# Altium schematic sheet Analog.SchDoc
size A3
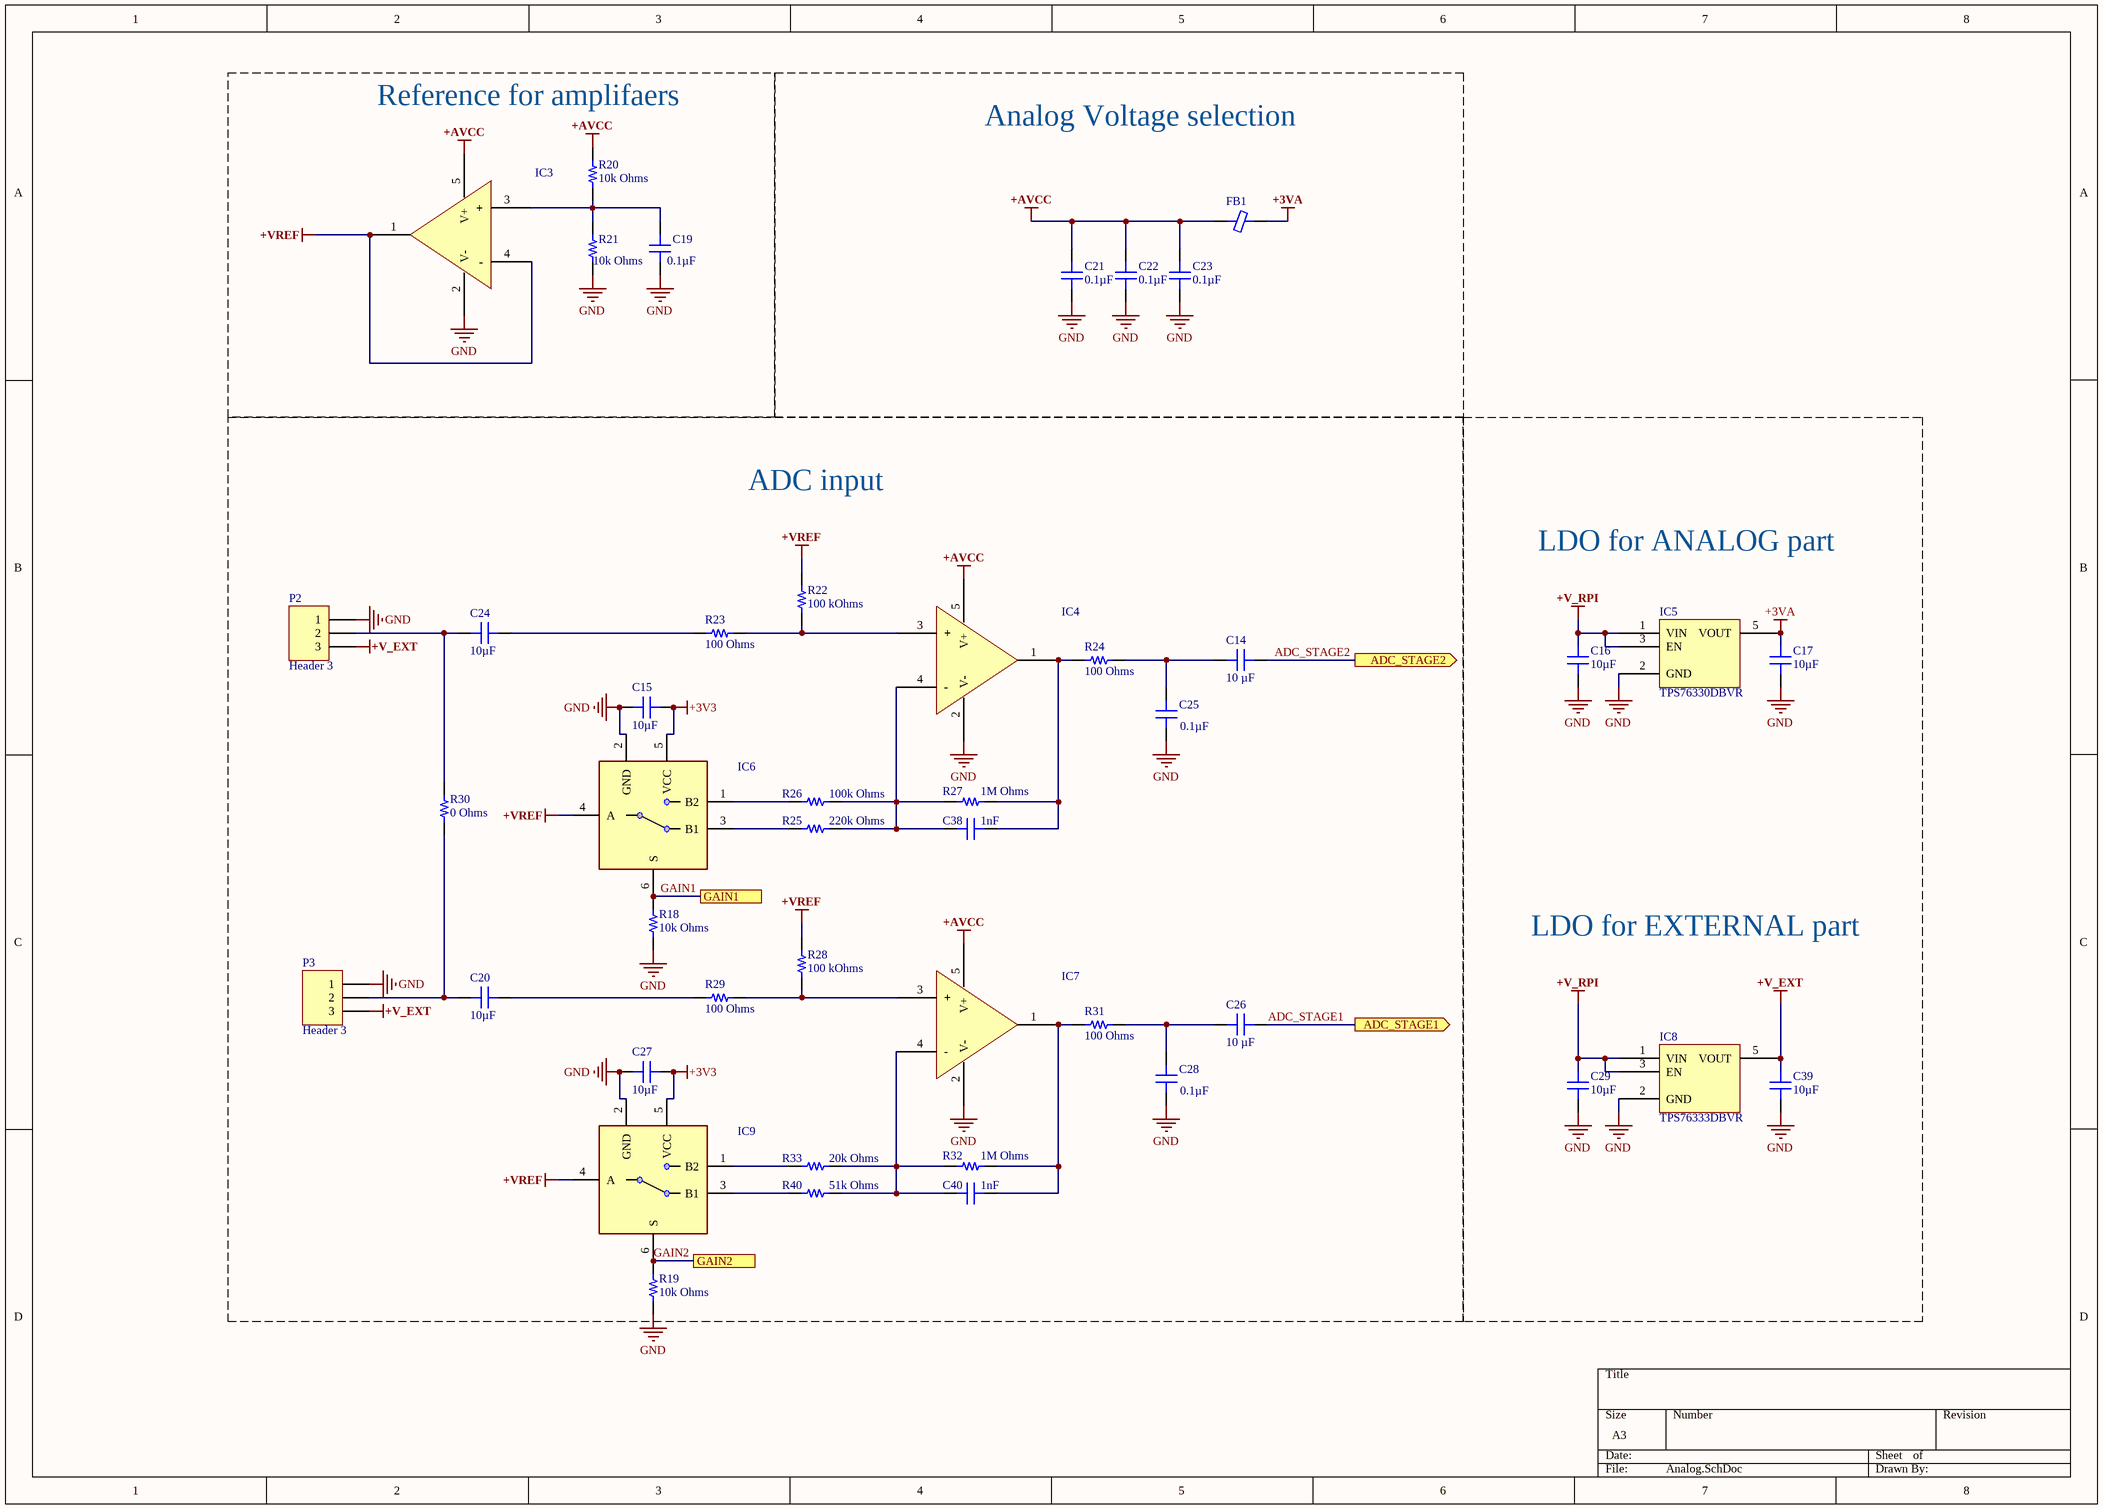
[diagram p0: Analog.SchDoc]

## Parts
C14  10 µF  [CAP 0603_1608]
C15  10µF  [CAP 0603_1608]
C16  10µF  [CAP 0603_1608]
C17  10µF  [CAP 0603_1608]
C19  0.1µF  [CAP 0603_1608]
C20  10µF  [CAP 0603_1608]
C21  0.1µF  [CAP 0603_1608]
C22  0.1µF  [CAP 0603_1608]
C23  0.1µF  [CAP 0603_1608]
C24  10µF  [CAP 0603_1608]
C25  0.1µF  [CAP 0603_1608]
C26  10 µF  [CAP 0603_1608]
C27  10µF  [CAP 0603_1608]
C28  0.1µF  [CAP 0603_1608]
C29  10µF  [CAP 0603_1608]
C38  1nF  [CAP 0603_1608]
C39  10µF  [CAP 0603_1608]
C40  1nF  [CAP 0603_1608]
FB1  (no value)  [FER 0603_1608]
IC3  AD8541ARTZ-REEL7  [ANALOG SOT-23-5 RJ-5]  (value not drawn)
IC4  AD8541ARTZ-REEL7  [ANALOG SOT-23-5 RJ-5]  (value not drawn)
IC5  TPS76330DBVR  [TI SOT-23-5 DBV]
IC6  SN74LVC1G3157DCK3  [SOT65P210X110-6N]  (value not drawn)
IC7  AD8541ARTZ-REEL7  [ANALOG SOT-23-5 RJ-5]  (value not drawn)
IC8  TPS76333DBVR  [TI SOT-23-5 DBV]
IC9  SN74LVC1G3157DCK3  [SOT65P210X110-6N]  (value not drawn)
P2  Header 3  [HDR1X3]
P3  Header 3  [HDR1X3]
R18  10k Ohms  [RES 0603_1608]
R19  10k Ohms  [RES 0603_1608]
R20  10k Ohms  [RES 0603_1608]
R21  10k Ohms  [RES 0603_1608]
R22  100 kOhms  [RES 0603_1608]
R23  100 Ohms  [RES 0603_1608]
R24  100 Ohms  [RES 0603_1608]
R25  220k Ohms  [RES 0603_1608]
R26  100k Ohms  [RES 0603_1608]
R27  1M Ohms  [RES 0603_1608]
R28  100 kOhms  [RES 0603_1608]
R29  100 Ohms  [RES 0603_1608]
R30  0 Ohms  [RES 0603_1608]
R31  100 Ohms  [RES 0603_1608]
R32  1M Ohms  [RES 0603_1608]
R33  20k Ohms  [RES 0603_1608]
R40  51k Ohms  [RES 0603_1608]

## Ports
ADC_STAGE1 (out), ADC_STAGE2 (out), GAIN1, GAIN2

## Nets
+3V3: C15.1 C27.1 IC6.5(VCC) IC9.5(VCC)
+3VA: C17.2 FB1.2 IC5.5(VOUT)
+AVCC: C21.2 C22.2 C23.2 FB1.1 IC3.5(V+) IC4.5(V+) IC7.5(V+) R20.2
+V_EXT: C39.2 IC8.5(VOUT) P2.3 P3.3
+V_RPI: C16.2 C29.2 IC5.1(VIN) IC5.3(EN) IC8.1(VIN) IC8.3(EN)
+VREF: IC3.1(OUT) IC3.4(-) IC6.4(A) IC9.4(A) R22.1 R28.1
GND: C15.2 C16.1 C17.1 C19.1 C21.1 C22.1 C23.1 C25.1 C27.2 C28.1 C29.1 C39.1 IC3.2(V-) IC4.2(V-) IC5.2(GND) IC6.2(GND) IC7.2(V-) IC8.2(GND) IC9.2(GND) P2.1 P3.1 R18.1 R19.1 R21.1
ADC_STAGE1: C26.2 ; port ADC_STAGE1
ADC_STAGE2: C14.2 ; port ADC_STAGE2
GAIN1: IC6.6(S) R18.2 ; port GAIN1
GAIN2: IC9.6(S) R19.2 ; port GAIN2
NetC14_1: C14.1 C25.2 R24.1
NetC19_2: C19.2 IC3.3(+) R20.1 R21.2
NetC20_1: C20.1 R29.2
NetC20_2: C20.2 P3.2 R30.2
NetC24_1: C24.1 R23.2
NetC24_2: C24.2 P2.2 R30.1
NetC26_1: C26.1 C28.2 R31.1
NetC38_1: C38.1 IC4.1(OUT) R24.2 R27.1
NetC38_2: C38.2 IC4.4(-) R25.1 R26.1 R27.2
NetC40_1: C40.1 IC7.1(OUT) R31.2 R32.1
NetC40_2: C40.2 IC7.4(-) R32.2 R33.1 R40.1
NetIC4_3: IC4.3(+) R22.2 R23.1
NetIC6_1: IC6.1(B2) R26.2
NetIC6_3: IC6.3(B1) R25.2
NetIC7_3: IC7.3(+) R28.2 R29.1
NetIC9_1: IC9.1(B2) R33.2
NetIC9_3: IC9.3(B1) R40.2

## Notes on the sheet
- (near R20) Reference for amplifaers
- Analog Voltage selection
- ADC input
- LDO for ANALOG part
- LDO for EXTERNAL part

## Library data of the parts
C14-C17 C19-C29 C38-C40 = 100X14W104MV4T: CAP CER 0.1UF 10V X7R 0603; Part Number: 100X14W104MV4T
  C14 C26: Value: 10 µF
  C15-C17 C20 C24 C27 C29 C39: Value: 10µF
  C19 C21-C23 C25 C28: Value: 0.1µF
  C38 C40: Value: 1nF
FB1 = 2506031217H0: FERRITE BEAD 0603 1LN; Part Number: 2506031217H0
IC3 IC4 IC7 = AD8541ARTZ-REEL7: IC OPAMP GP 1 CIRCUIT SOT23-5; Manufacturer: Analog Devices Inc.; Amplifier Type: General Purpose; Current - Input Bias: 4pA; Current - Output / Channel: 30mA; Current - Supply: 45µA; Gain Bandwidth Product: 1MHz; Number of Circuits: 1; Output Type: Rail-to-Rail; Slew Rate: 0.92V/µs; Voltage - Input Offset: 1mV; Voltage - Supply, Single/Dual (±): 2.7V ~ 5.5V; Part Number: AD8541ARTZ-REEL7; ComponentLink1Description: Datasheet; ComponentLink1URL: https://www.analog.com/media/en/technical-documentation/data-sheets/AD8541_8542_8544.pdf; ComponentLink2Description: DigiKey Link; ComponentLink2URL: http://digikey.com/product-detail/en/analog-devices-inc/AD8541ARTZ-REEL7/AD8541ARTZ-REEL7CT-ND/813416; Device Package: SC-74A, SOT-753; LastUpdated: 08.01.2020 23:39:15; Lifecycle Status: Active; Minimum Order: 1; Mounting Type: Surface Mount; Operating Temperature: -40°C ~ 125°C; Package / Case: SC-74A, SOT-753; Packaging: ReReel; PartId: 9; Part Status: Active; Price: 0.00; Series: -; Supplier 1: DigiKey; Supplier Part Number 1: AD8541ARTZ-REEL7CT-ND; Supplier Device Package: SOT-23-5
IC5 = TPS76330DBVR: IC REG LINEAR 3V 150MA SOT23-5; Manufacturer: Texas Instruments; Control Features: Enable; Current - Quiescent (Iq): 100µA; Current - Supply (Max): 140µA; Number of Regulators: 1; Output Configuration: Positive; Output Type: Fixed; Protection Features: Over Current, Over Temperature, Reverse Polarity; PSRR: 60dB (1kHz); Voltage - Input (Max): 10V; Part Number: TPS76330DBVR; ComponentLink1Description: Datasheet; ComponentLink1URL: http://www.ti.com/general/docs/suppproductinfo.tsp?distId=10&gotoUrl=http%3A%2F%2Fwww.ti.com%2Flit%2Fgpn%2Ftps763; ComponentLink2Description: DigiKey Link; ComponentLink2URL: http://digikey.com/product-detail/en/texas-instruments/TPS76330DBVR/296-11020-1-ND/477336; Current - Output: 150mA; LastUpdated: 02.09.2020 1:24:38; Lifecycle Status: Active; Minimum Order: 1; Mounting Type: Surface Mount; Operating Temperature: -40°C ~ 125°C; Package / Case: SC-74A, SOT-753; Packaging: TapeAndReel; Part Status: Active; Price: 0.33; Series: -; Supplier 1: DigiKey; Supplier Part Number 1: 296-11020-1-ND; Supplier Device Package: SOT-23-5; Voltage - Output (Min/Fixed): 3V
IC6 IC9 = SN74LVC1G3157DCK3: Integrated Circuit; Manufacturer_Name: Texas Instruments; Datasheet Link: http://www.ti.com/general/docs/suppproductinfo.tsp?distId=26&gotoUrl=http%3A%2F%2Fwww.ti.com%2Flit%2Fgpn%2FSN74LVC1G3157; Height: 1.1mm; Manufacturer_Part_Number: SN74LVC1G3157DCK3; Mouser Part Number: 595-74LVC1G3157DCK3; Mouser Price/Stock: https://www.mouser.co.uk/ProductDetail/Texas-Instruments/SN74LVC1G3157DCK3?qs=gHXEOK8GIg%2FmbZPnkwnSeQ%3D%3D; Arrow Part Number: SN74LVC1G3157DCK3; Arrow Price/Stock: https://www.arrow.com/en/products/sn74lvc1g3157dck3/texas-instruments
IC8 = TPS76333DBVR: IC REG LINEAR 3.3V 150MA SOT23-5; Part Number: TPS76333DBVR
P2 P3 = Header 3: Header, 3-Pin; LatestRevisionDate: 17-Jul-2002; LatestRevisionNote: Re-released for DXP Platform.; Publisher: Altium Limited
R18-R33 R40 = RNCS0603BKE100R: RES 100 OHM 0.1% 1/16W 0603; Part Number: RNCS0603BKE100R
  R18-R21: Value: 10k Ohms
  R22 R28: Value: 100 kOhms
  R23 R24 R29 R31: Value: 100 Ohms
  R25: Value: 220k Ohms
  R26: Value: 100k Ohms
  R27 R32: Value: 1M Ohms
  R30: Value: 0 Ohms
  R33: Value: 20k Ohms
  R40: Value: 51k Ohms